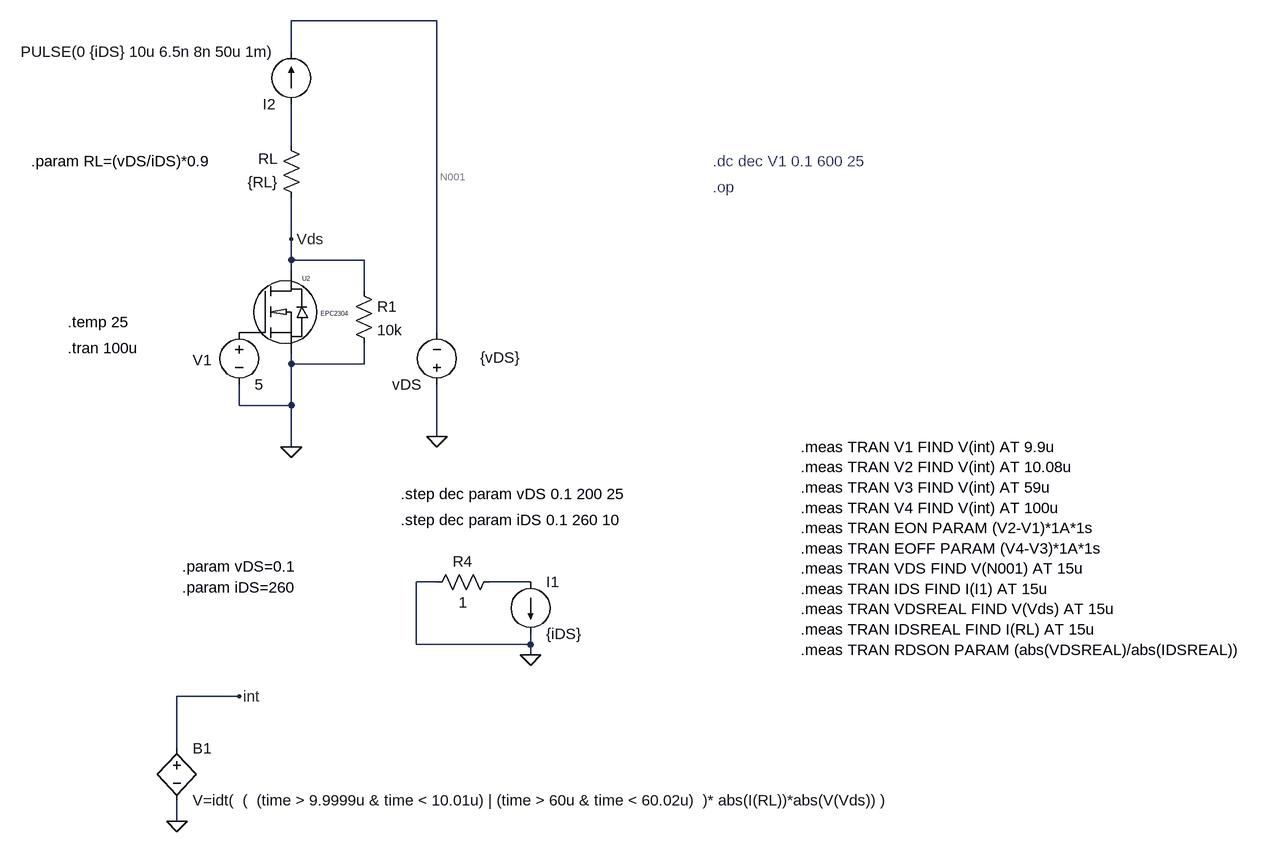
[diagram p0: schematic Eon_Eoff_circuit_reverse.asc]
Eon_Eoff_circuit_reverse.asc, the LTspice schematic file:
Version 4.1
SHEET 1 2248 932
WIRE 448 -320 224 -320
WIRE 224 -272 224 -320
WIRE 224 -128 224 -192
WIRE 224 16 224 -48
WIRE 224 48 224 16
WIRE 336 48 224 48
WIRE 224 64 224 48
WIRE 336 96 336 48
WIRE 448 160 448 -320
WIRE 224 208 224 192
WIRE 336 208 336 176
WIRE 336 208 224 208
WIRE 144 272 144 240
WIRE 224 272 224 208
WIRE 224 272 144 272
WIRE 448 320 448 240
WIRE 224 336 224 272
WIRE 448 544 416 544
WIRE 592 544 528 544
WIRE 416 640 416 544
WIRE 592 640 592 624
WIRE 592 640 416 640
WIRE 592 656 592 640
WIRE 144 720 48 720
WIRE 48 800 48 720
WIRE 48 912 48 880
FLAG 448 320 0
FLAG 224 336 0
FLAG 48 912 0
FLAG 144 720 int
FLAG 592 656 0
FLAG 224 16 Vds
SYMBOL voltage 448 256 R180
WINDOW 123 0 0 Left 0
WINDOW 39 0 0 Left 0
WINDOW 3 -128 58 Left 2
SYMATTR Value {vDS}
SYMATTR InstName vDS
SYMBOL res 240 -32 R180
WINDOW 0 36 76 Left 2
WINDOW 3 36 40 Left 2
SYMATTR InstName RL
SYMATTR Value {RL}
SYMBOL bv 48 784 R0
SYMATTR InstName B1
SYMATTR Value V=idt(  (  (time > 9.9999u & time < 10.01u) | (time > 60u & time < 60.02u)  )* abs(I(RL))*abs(V(Vds)) )
SYMBOL current 592 544 R0
WINDOW 123 0 0 Left 0
WINDOW 39 0 0 Left 0
SYMATTR InstName I1
SYMATTR Value {iDS}
SYMBOL res 544 528 R90
WINDOW 0 0 56 VBottom 2
WINDOW 3 32 56 VTop 2
SYMATTR InstName R4
SYMATTR Value 1
SYMBOL EPCGaN 144 160 R0
SYMATTR InstName U2
SYMBOL voltage 144 144 R0
WINDOW 0 -72 58 Left 2
WINDOW 123 0 0 Left 0
WINDOW 39 0 0 Left 0
SYMATTR InstName V1
SYMATTR Value 5
SYMBOL current 224 -192 R180
WINDOW 123 0 0 Left 0
WINDOW 39 0 0 Left 0
SYMATTR InstName I2
SYMATTR Value PULSE(0 {iDS} 10u 6.5n 8n 50u 1m)
SYMBOL res 320 80 R0
SYMATTR InstName R1
SYMATTR Value 10k
TEXT 872 -104 Left 2 ;.dc dec V1 0.1 600 25
TEXT -176 -104 Left 2 !.param RL=(vDS/iDS)*0.9
TEXT 56 520 Left 2 !.param vDS=0.1
TEXT 56 552 Left 2 !.param iDS=260
TEXT 872 -64 Left 2 ;.op
TEXT 392 408 Left 2 !.step dec param vDS 0.1 200 25
TEXT 392 448 Left 2 !.step dec param iDS 0.1 260 10
TEXT -120 184 Left 2 !.tran 100u
TEXT 1008 336 Left 2 !.meas TRAN V1 FIND V(int) AT 9.9u\n.meas TRAN V2 FIND V(int) AT 10.08u\n.meas TRAN V3 FIND V(int) AT 59u\n.meas TRAN V4 FIND V(int) AT 100u\n.meas TRAN EON PARAM (V2-V1)*1A*1s\n.meas TRAN EOFF PARAM (V4-V3)*1A*1s\n.meas TRAN VDS FIND V(N001) AT 15u\n.meas TRAN IDS FIND I(I1) AT 15u\n.meas TRAN VDSREAL FIND V(Vds) AT 15u\n.meas TRAN IDSREAL FIND I(RL) AT 15u\n.meas TRAN RDSON PARAM (abs(VDSREAL)/abs(IDSREAL))
TEXT -120 144 Left 2 !.temp 25

The netlist it stands for:
* Eon_Eoff_circuit_reverse.asc
vDS 0 N001 {vDS}
RL Vds N002 {RL}
B1 int 0 V=idt(  (  (time > 9.9999u & time < 10.01u) | (time > 60u & time < 60.02u)  )* abs(I(RL))*abs(V(Vds)) )
I1 N003 0 {iDS}
R4 N003 0 1
X§U2 P001 Vds 0 EPC2304  ; pins gatein drainin N_0
V1 P001 0 5
I2 N002 N001 PULSE(0 {iDS} 10u 6.5n 8n 50u 1m)
R1 Vds 0 10k
* .dc dec V1 0.1 600 25
.param RL=(vDS/iDS)*0.9
.param vDS=0.1
.param iDS=260
* .op
.step dec param vDS 0.1 200 25
.step dec param iDS 0.1 260 10
.tran 100u
.meas TRAN V1 FIND V(int) AT 9.9u
.meas TRAN V2 FIND V(int) AT 10.08u
.meas TRAN V3 FIND V(int) AT 59u
.meas TRAN V4 FIND V(int) AT 100u
.meas TRAN EON PARAM (V2-V1)*1A*1s
.meas TRAN EOFF PARAM (V4-V3)*1A*1s
.meas TRAN VDS FIND V(N001) AT 15u
.meas TRAN IDS FIND I(I1) AT 15u
.meas TRAN VDSREAL FIND V(Vds) AT 15u
.meas TRAN IDSREAL FIND I(RL) AT 15u
.meas TRAN RDSON PARAM (abs(VDSREAL)/abs(IDSREAL))
.temp 25
.lib EPCGanlibrary.lib
.backanno
.end